# Altium schematic sheet Main.SchDoc: ThunderScope 1000E
size A4; DrawnBy: Aleksa Bjelogrlic; Revision: 1
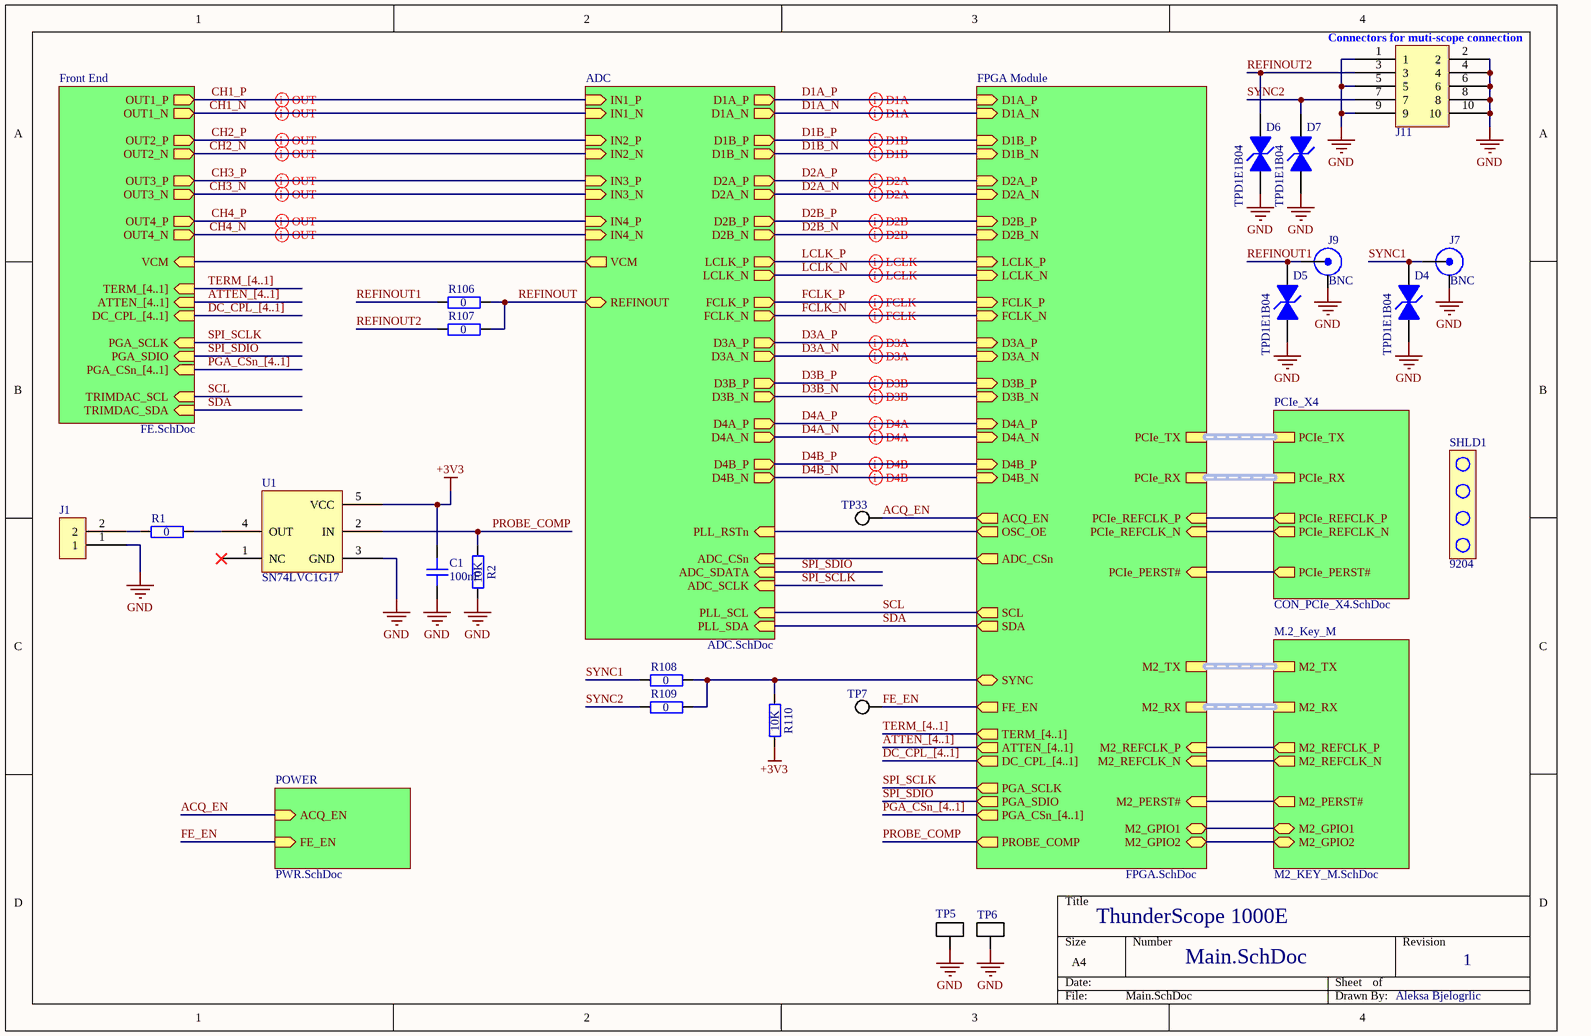
[diagram p0: Main.SchDoc]

## Parts
C1  100nF  [GEN_C_0402]
D4  TPD1E1B04  [TI_X1SON_DPY0002A]
D5  TPD1E1B04  [TI_X1SON_DPY0002A]
D6  TPD1E1B04  [TI_X1SON_DPY0002A]
D7  TPD1E1B04  [TI_X1SON_DPY0002A]
J1  TSW-101-08-F-D-RA  [GEN_2.54mm_1x2_Pin_TH_RA]  (value not drawn)
J7  BNC  [MOL_0731000105]
J9  BNC  [MOL_0731000105]
J11  1.27mm 6 Pin TH  [GEN_1.27mm_2x5_Pin_TH_RA]  (value not drawn)
R1  0  [GEN_R_0402]
R2  10K  [GEN_R_0402]
R106  0  [GEN_R_0402]
R107  0  [GEN_R_0402]
R108  0  [GEN_R_0402]
R109  0  [GEN_R_0402]
R110  10K  [GEN_R_0402]
SHLD1  9204  (mechanical)
TP5  5019  [KEY_5019]  (value not drawn)
TP6  5019  [KEY_5019]  (value not drawn)
TP7  PCB  [GEN_TP_PCB]  (value not drawn)  (no BOM)
TP33  PCB  [GEN_TP_PCB]  (value not drawn)  (no BOM)
U1  SN74LVC1G17  [GEN_SC-70-5]

## Sub-sheets
ADC = ADC.SchDoc: IN4_N (in), IN4_P (in), IN3_N (in), IN3_P (in), IN2_N (in), IN2_P (in), VCM (out), IN1_N (in), IN1_P (in), ADC_CSn (in), ADC_SDATA (in), ADC_SCLK (in), D1A_N (out), D1A_P (out), D1B_P (out), D1B_N (out), D2A_P (out), D2A_N (out), D2B_N (out), D2B_P (out), LCLK_P (out), LCLK_N (out), FCLK_N (out), FCLK_P (out), D3A_P (out), D3A_N (out), D3B_P (out), D3B_N (out), D4A_P (out), D4A_N (out), D4B_P (out), D4B_N (out), PLL_RSTn (in), PLL_SDA (in), PLL_SCL (in), REFINOUT (bidir)
FPGA Module = FPGA.SchDoc: D1A_P (in), D1A_N (in), D1B_P (in), D1B_N (in), D2A_P (in), D2A_N (in), D2B_P (in), D2B_N (in), LCLK_P (in), LCLK_N (in), FCLK_P (in), FCLK_N (in), D3A_P (in), D3A_N (in), D3B_P (in), D3B_N (in), D4A_P (in), D4A_N (in), D4B_P (in), D4B_N (in), ACQ_EN (out), OSC_OE (out), ADC_CSn (out), SCL (out), SDA (out), FE_EN (out), ATTEN_[4..1] (out), DC_CPL_[4..1] (out), PGA_SCLK (out), PGA_SDIO (out), PGA_CSn_[4..1] (out), PROBE_COMP (out), PCIe_REFCLK_N (in), PCIe_PERST# (in), PCIe_REFCLK_P (in), PCIe_TX (harness PCIe_X4_TX), PCIe_RX (harness PCIe_X4_RX), M2_REFCLK_N (in), M2_PERST# (in), M2_REFCLK_P (in), M2_TX (harness M2_X4_TX), M2_RX (harness M2_X4_RX), TERM_[4..1] (out), M2_GPIO1 (bidir), M2_GPIO2 (bidir), SYNC (bidir)
Front End = FE.SchDoc: OUT1_P (out), OUT1_N (out), OUT3_P (out), OUT3_N (out), OUT4_N (out), OUT2_N (out), OUT2_P (out), OUT4_P (out), VCM (in), DC_CPL_[4..1] (in), ATTEN_[4..1] (in), PGA_SCLK (in), PGA_CSn_[4..1] (in), PGA_SDIO (in), TRIMDAC_SCL (in), TRIMDAC_SDA (in), TERM_[4..1] (in)
M.2_Key_M = M2_KEY_M.SchDoc: M2_REFCLK_N (out), M2_PERST# (out), M2_REFCLK_P (out), M2_TX (harness M2_X4_TX), M2_RX (harness M2_X4_RX), M2_GPIO1 (bidir), M2_GPIO2 (bidir)
PCIe_X4 = CON_PCIe_X4.SchDoc: PCIe_REFCLK_N (out), PCIe_PERST# (out), PCIe_REFCLK_P (out), PCIe_TX (harness PCIe_X4_TX), PCIe_RX (harness PCIe_X4_RX)
POWER = PWR.SchDoc: FE_EN (in), ACQ_EN (in)

## Nets
+3V3: C1.1 R110.1 U1.5(VCC)
GND: C1.2 D4.2(A) D5.2(A) D6.2(A) D7.2(A) J1.1 J7.2(SHIELD) J9.2(SHIELD) J11.1 J11.2 J11.4 J11.5 J11.6 J11.8 J11.9 J11.10 R2.1 TP5.1 TP6.1 U1.3(GND)
ACQ_EN: TP33.1 ; sheet FPGA Module/ACQ_EN, sheet POWER/ACQ_EN
CH1_N: sheet Front End/OUT1_N, sheet ADC/IN1_N
CH1_P: sheet Front End/OUT1_P, sheet ADC/IN1_P
CH2_N: sheet Front End/OUT2_N, sheet ADC/IN2_N
CH2_P: sheet Front End/OUT2_P, sheet ADC/IN2_P
CH3_N: sheet Front End/OUT3_N, sheet ADC/IN3_N
CH3_P: sheet Front End/OUT3_P, sheet ADC/IN3_P
CH4_N: sheet Front End/OUT4_N, sheet ADC/IN4_N
CH4_P: sheet Front End/OUT4_P, sheet ADC/IN4_P
D1A_N: sheet ADC/D1A_N, sheet FPGA Module/D1A_N
D1A_P: sheet ADC/D1A_P, sheet FPGA Module/D1A_P
D1B_N: sheet ADC/D1B_N, sheet FPGA Module/D1B_N
D1B_P: sheet ADC/D1B_P, sheet FPGA Module/D1B_P
D2A_N: sheet ADC/D2A_N, sheet FPGA Module/D2A_N
D2A_P: sheet ADC/D2A_P, sheet FPGA Module/D2A_P
D2B_N: sheet ADC/D2B_N, sheet FPGA Module/D2B_N
D2B_P: sheet ADC/D2B_P, sheet FPGA Module/D2B_P
D3A_N: sheet ADC/D3A_N, sheet FPGA Module/D3A_N
D3A_P: sheet ADC/D3A_P, sheet FPGA Module/D3A_P
D3B_N: sheet ADC/D3B_N, sheet FPGA Module/D3B_N
D3B_P: sheet ADC/D3B_P, sheet FPGA Module/D3B_P
D4A_N: sheet ADC/D4A_N, sheet FPGA Module/D4A_N
D4A_P: sheet ADC/D4A_P, sheet FPGA Module/D4A_P
D4B_N: sheet ADC/D4B_N, sheet FPGA Module/D4B_N
D4B_P: sheet ADC/D4B_P, sheet FPGA Module/D4B_P
FCLK_N: sheet ADC/FCLK_N, sheet FPGA Module/FCLK_N
FCLK_P: sheet ADC/FCLK_P, sheet FPGA Module/FCLK_P
FE_EN: TP7.1 ; sheet FPGA Module/FE_EN, sheet POWER/FE_EN
LCLK_N: sheet ADC/LCLK_N, sheet FPGA Module/LCLK_N
LCLK_P: sheet ADC/LCLK_P, sheet FPGA Module/LCLK_P
PROBE_COMP: R2.2 U1.2(IN) ; sheet FPGA Module/PROBE_COMP
REFINOUT: R106.2 R107.2 ; sheet ADC/REFINOUT
REFINOUT1: D5.1(K) J9.1(Signal) R106.1
REFINOUT2: D6.1(K) J11.3 R107.1
SCL: sheet Front End/TRIMDAC_SCL, sheet ADC/PLL_SCL, sheet FPGA Module/SCL
SDA: sheet Front End/TRIMDAC_SDA, sheet ADC/PLL_SDA, sheet FPGA Module/SDA
SPI_SCLK: sheet Front End/PGA_SCLK, sheet ADC/ADC_SCLK, sheet FPGA Module/PGA_SCLK
SPI_SDIO: sheet Front End/PGA_SDIO, sheet ADC/ADC_SDATA, sheet FPGA Module/PGA_SDIO
SYNC1: D4.1(K) J7.1(Signal) R108.1
SYNC2: D7.1(K) J11.7 R109.1
NetJ1_2: J1.2 R1.1
NetR1_2: R1.2 U1.4(OUT)
NetR108_2: R108.2 R109.2 R110.2 ; sheet FPGA Module/SYNC
(unnamed): sheet Front End/VCM, sheet ADC/VCM
(unnamed): sheet ADC/ADC_CSn, sheet FPGA Module/ADC_CSn
(unnamed): sheet ADC/PLL_RSTn, sheet FPGA Module/OSC_OE
(unnamed): sheet FPGA Module/PCIe_REFCLK_N, sheet PCIe_X4/PCIe_REFCLK_N
(unnamed): sheet FPGA Module/PCIe_PERST#, sheet PCIe_X4/PCIe_PERST#
(unnamed): sheet FPGA Module/PCIe_REFCLK_P, sheet PCIe_X4/PCIe_REFCLK_P
(unnamed): sheet FPGA Module/M2_REFCLK_N, sheet M.2_Key_M/M2_REFCLK_N
(unnamed): sheet FPGA Module/M2_PERST#, sheet M.2_Key_M/M2_PERST#
(unnamed): sheet FPGA Module/M2_REFCLK_P, sheet M.2_Key_M/M2_REFCLK_P
(unnamed): sheet FPGA Module/M2_GPIO1, sheet M.2_Key_M/M2_GPIO1
(unnamed): sheet FPGA Module/M2_GPIO2, sheet M.2_Key_M/M2_GPIO2

Not connected (* = marked no-connect by the designer): U1 1(NC)*

## Buses and harness runs
bus ATTEN_[4..1] = sheet FPGA Module/ATTEN_[4..1]
bus ATTEN_[4..1] = sheet Front End/ATTEN_[4..1]
bus DC_CPL_[4..1] = sheet FPGA Module/DC_CPL_[4..1]
bus DC_CPL_[4..1] = sheet Front End/DC_CPL_[4..1]
bus PGA_CSn_[4..1] = sheet FPGA Module/PGA_CSn_[4..1]
bus PGA_CSn_[4..1] = sheet Front End/PGA_CSn_[4..1]
bus TERM_[4..1] = sheet FPGA Module/TERM_[4..1]
bus TERM_[4..1] = sheet Front End/TERM_[4..1]
harness sheet FPGA Module/M2_RX = sheet M.2_Key_M/M2_RX
harness sheet FPGA Module/M2_TX = sheet M.2_Key_M/M2_TX
harness sheet FPGA Module/PCIe_RX = sheet PCIe_X4/PCIe_RX
harness sheet FPGA Module/PCIe_TX = sheet PCIe_X4/PCIe_TX

## Layout directives
differential pair: D1A_N, D1A_P, D1B_N, D1B_P, D2A_N, D2A_P, D2B_N, D2B_P, D3A_N, D3A_P, D3B_N, D3B_P, D4A_N, D4A_P, D4B_N, D4B_P, FCLK_N, FCLK_P, LCLK_N, LCLK_P
differential pair; differential pair class 100Z_Diff_PGA: CH1_N, CH1_P, CH2_N, CH2_P, CH3_N, CH3_P, CH4_N, CH4_P

## Notes on the sheet
- (near J11) Connectors for muti-scope connection
- Aleksa Bjelogrlic

## Library data of the parts
C1 = CAP 100nF 16V X7R 0402: Voltage Rating: 16V; Package: 0402; Supplier 1: Digi-Key; Supplier Part Number 1: 490-4759-1-ND; Value: 100nF
D4-D7 = TVS TPD1E1B04: Supplier 1: Digi-Key; Supplier Part Number 1: 296-47364-1-ND
J1 = CONN 2.54mm 2 Pin TH RA: Supplier 1: Digi-Key; Supplier Part Number 1: SAM12296-ND
J7 J9 = BNC JACK R/A: Supplier 1: Digi-Key; Supplier Part Number 1: WM5524-ND
J11 = CONN 1.27mm 2x5 Pin TH RA: Supplier 1: Digi-Key; Supplier Part Number 1: 1175-1628-ND
R1 R106-R109 = RES 0 OHM 1/16W 0402: Power Rating: 0.0625W; Package: 0402; Supplier 1: Digi-Key; Supplier Part Number 1: 311-0.0JRCT-ND; Value: 0
R2 R110 = RES 10K OHM 1% 1/10W 0402: Tolerance: 1%; Power Rating: 0.1W; Package: 0402; Supplier 1: Digi-Key; Supplier Part Number 1: P10.0KLCT-ND; Value: 10K
SHLD1 = PCIe IO Shield: Supplier 1: Mouser; Supplier Part Number 1: 534-9204
TP5 TP6 = TP KEYSTONE 5019: Supplier 1: Digi-Key; Supplier Part Number 1: 36-5019CT-ND
TP7 TP33 = TP PCB 1mm
U1 = IC BUFFER SN74LVC1G17: Supplier 1: Digi-Key; Supplier Part Number 1: 296-11934-1-ND